# Altium project MotorDriver.PrjPCB
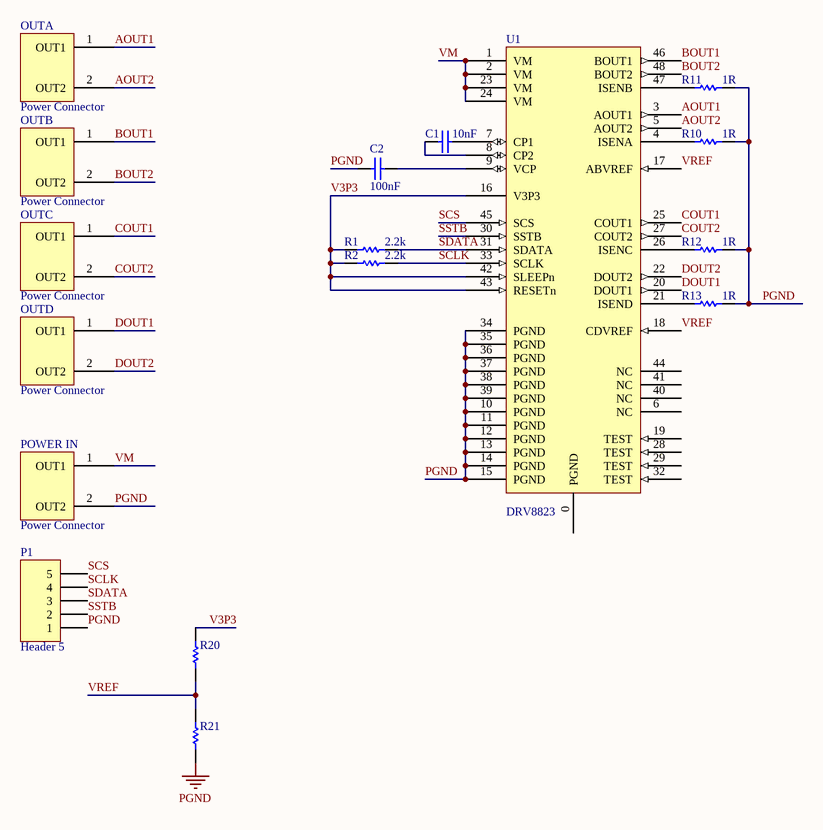
[diagram p0: Main_v0.1.SchDoc]
1 sheet, 17 parts. Net scope: global (net labels, ports and power ports of the same name join across sheets).
Board files: Panel driver v0.1.PcbDoc, Mainv0.1.PcbDoc

## Sheet Main_v0.1.SchDoc
size A4

### Parts
C1  value 10nF  [C1206]  (hidden comment: Cap Semi)
C2  value 100nF  [C1206]  (hidden comment: Cap Semi)
OUTA  Power Connector  [PCBComponent_1]
OUTB  Power Connector  [PCBComponent_1]
OUTC  Power Connector  [PCBComponent_1]
OUTD  Power Connector  [PCBComponent_1]
P1  Header 5  [HDR1X5]
POWER_IN  Power Connector  [PCBComponent_1]
R1  value 2.2k  [AXIAL-0.3]  (hidden comment: Res1)
R2  value 2.2k  [AXIAL-0.3]  (hidden comment: Res1)
R10  value 1R  [AXIAL-0.3]  (hidden comment: Res1)
R11  value 1R  [AXIAL-0.3]  (hidden comment: Res1)
R12  value 1R  [AXIAL-0.3]  (hidden comment: Res1)
R13  value 1R  [AXIAL-0.3]  (hidden comment: Res1)
R20  Res1  [AXIAL-0.3]  (value not drawn)
R21  Res1  [AXIAL-0.3]  (value not drawn)
U1  DRV8823  [TSSOP50P810X120_HS-49N]

### Nets
PGND: C2.1 P1.1 POWER_IN.2(OUT2) R10.2 R11.2 R12.2 R13.2 R21.1 U1.10(PGND) U1.11(PGND) U1.12(PGND) U1.13(PGND) U1.14(PGND) U1.15(PGND) U1.34(PGND) U1.35(PGND) U1.36(PGND) U1.37(PGND) U1.38(PGND) U1.39(PGND)
AOUT1: OUTA.1(OUT1) U1.3(AOUT1)
AOUT2: OUTA.2(OUT2) U1.5(AOUT2)
BOUT1: OUTB.1(OUT1) U1.46(BOUT1)
BOUT2: OUTB.2(OUT2) U1.48(BOUT2)
COUT1: OUTC.1(OUT1) U1.25(COUT1)
COUT2: OUTC.2(OUT2) U1.27(COUT2)
DOUT1: OUTD.1(OUT1) U1.20(DOUT1)
DOUT2: OUTD.2(OUT2) U1.22(DOUT2)
SCLK: P1.4 R2.2 U1.33(SCLK)
SCS: P1.5 U1.45(SCS)
SDATA: P1.3 R1.2 U1.31(SDATA)
SSTB: P1.2 U1.30(SSTB)
V3P3: R1.1 R2.1 R20.2 U1.16(V3P3) U1.42(SLEEPn) U1.43(RESETn)
VM: POWER_IN.1(OUT1) U1.1(VM) U1.2(VM) U1.23(VM) U1.24(VM)
VREF: R20.1 R21.2 U1.17(ABVREF) U1.18(CDVREF)
NetC1_1: C1.1 U1.8(CP2)
NetC1_2: C1.2 U1.7(CP1)
NetC2_2: C2.2 U1.9(VCP)
NetR10_1: R10.1 U1.4(ISENA)
NetR11_1: R11.1 U1.47(ISENB)
NetR12_1: R12.1 U1.26(ISENC)
NetR13_1: R13.1 U1.21(ISEND)

Not connected (* = marked no-connect by the designer): U1 0(PGND) 6(NC) 19(TEST) 28(TEST) 29(TEST) 32(TEST) 40(NC) 41(NC) 44(NC)

### Library data of the parts
C1 C2 = Cap Semi: Capacitor (Semiconductor SIM Model); Published: 8-Jun-2000; LatestRevisionDate: 29-May-2009; LatestRevisionNote: IPC-7351 Footprint Added.; PackageReference: C1206; Publisher: Altium Limited; PackageDescription: Chip Capacitor
P1 = Header 5: Header, 5-Pin; LatestRevisionDate: 17-Jul-2002; LatestRevisionNote: Re-released for DXP Platform.; Publisher: Altium Limited
R1 R2 R10-R13 = Res1: Resistor; Published: 8-Jun-2000; LatestRevisionDate: 17-Jul-2002; LatestRevisionNote: Re-released for DXP Platform.; PackageReference: AXIAL-0.3; Publisher: Altium Limited; PackageDescription: Axial Device, Thru-Hole; 2 Leads; 0.3 in Pin Spacing
R20 R21 = Res1: Resistor; Value: 1K; Published: 8-Jun-2000; LatestRevisionDate: 17-Jul-2002; LatestRevisionNote: Re-released for DXP Platform.; PackageReference: AXIAL-0.3; Publisher: Altium Limited; PackageDescription: Axial Device, Thru-Hole; 2 Leads; 0.3 in Pin Spacing
U1 = DRV8823: 4-BRIDGE  SERIAL  INTERFACE  MOTOR  DRIVER